# Altium schematic sheet USB_HUB.SchDoc
size Letter; SheetNumber: 10; SheetTotal: 15
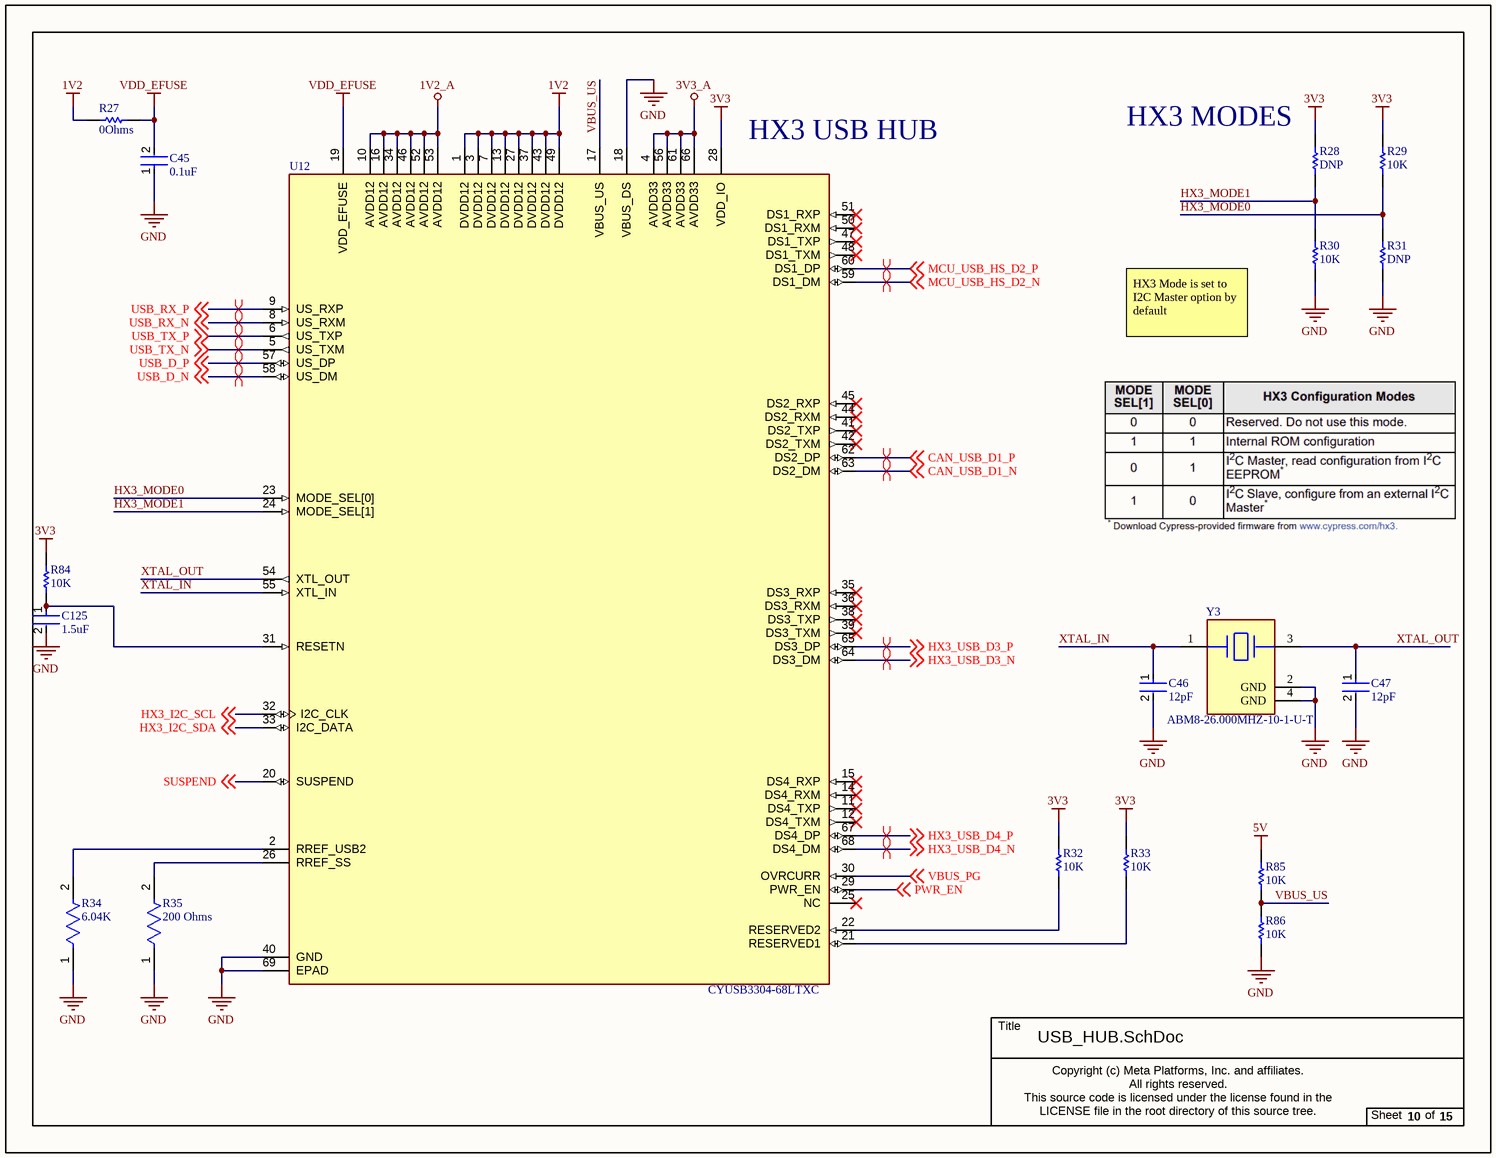
[diagram p0: USB_HUB.SchDoc]

## Parts
C45  0.1uF  [FP-CC0201-BA-MFG]
C46  12pF  [FP-0402-L_1_0_1-W_0_5_0_1-IPC_B]
C47  12pF  [FP-0402-L_1_0_1-W_0_5_0_1-IPC_B]
C125  1.5uF  [FP-C1005-050-0_05-IPC_A]
R27  0Ohms  [RESC1005X40X25ML05T10]
R28  DNP  [RESC1005X40X25ML05T10]
R29  10K  [RESC1005X40X25ML05T10]
R30  10K  [RESC1005X40X25ML05T10]
R31  DNP  [RESC1005X40X25ML05T10]
R32  10K  [RESC1005X40X25ML05T10]
R33  10K  [RESC1005X40X25ML05T10]
R34  6.04K  [FP-RMCF0402-IPC_A]
R35  200 Ohms  [FP-RMCF0402-IPC_B]
R84  10K  [RESC1005X40X25ML05T10]
R85  10K  [RESC1005X40X25ML05T10]
R86  10K  [RESC1005X40X25ML05T10]
U12  CYUSB3304-68LTXC  [QFN40P800X800X100-69M]
Y3  ABM8-26.000MHZ-10-1-U-T  [FP-ABM8-MFG]

## Nets
1V2: R27.2 U12.1(DVDD12) U12.3(DVDD12) U12.7(DVDD12) U12.13(DVDD12) U12.27(DVDD12) U12.37(DVDD12) U12.43(DVDD12) U12.49(DVDD12)
1V2_A: U12.10(AVDD12) U12.16(AVDD12) U12.34(AVDD12) U12.46(AVDD12) U12.52(AVDD12) U12.53(AVDD12)
3V3: R28.2 R29.2 R32.2 R33.2 R84.2 U12.28(VDD_IO)
3V3_A: U12.4(AVDD33) U12.56(AVDD33) U12.61(AVDD33) U12.66(AVDD33)
5V: R85.2
GND: C45.1 C46.2 C47.2 C125.2 R30.1 R31.1 R34.1 R35.1 R86.1 U12.18(VBUS_DS) U12.40(GND) U12.69(EPAD) Y3.2(GND) Y3.4(GND)
VDD_EFUSE: C45.2 R27.1 U12.19(VDD_EFUSE)
CAN_USB_D1_N: U12.63(DS2_DM) ; off-sheet CAN_USB_D1_N
CAN_USB_D1_P: U12.62(DS2_DP) ; off-sheet CAN_USB_D1_P
HX3_I2C_SCL: U12.32(I2C_CLK) ; off-sheet HX3_I2C_SCL
HX3_I2C_SDA: U12.33(I2C_DATA) ; off-sheet HX3_I2C_SDA
HX3_MODE0: R29.1 R31.2 U12.23(MODE_SEL[0])
HX3_MODE1: R28.1 R30.2 U12.24(MODE_SEL[1])
HX3_USB_D3_N: U12.64(DS3_DM) ; off-sheet HX3_USB_D3_N
HX3_USB_D3_P: U12.65(DS3_DP) ; off-sheet HX3_USB_D3_P
HX3_USB_D4_N: U12.68(DS4_DM) ; off-sheet HX3_USB_D4_N
HX3_USB_D4_P: U12.67(DS4_DP) ; off-sheet HX3_USB_D4_P
MCU_USB_HS_D2_N: U12.59(DS1_DM) ; off-sheet MCU_USB_HS_D2_N
MCU_USB_HS_D2_P: U12.60(DS1_DP) ; off-sheet MCU_USB_HS_D2_P
PWR_EN: U12.29(PWR_EN) ; off-sheet PWR_EN
SUSPEND: U12.20(SUSPEND) ; off-sheet SUSPEND
USB_D_N: U12.58(US_DM) ; off-sheet USB_D_N
USB_D_P: U12.57(US_DP) ; off-sheet USB_D_P
USB_RX_N: U12.8(US_RXM) ; off-sheet USB_RX_N
USB_RX_P: U12.9(US_RXP) ; off-sheet USB_RX_P
USB_TX_N: U12.5(US_TXM) ; off-sheet USB_TX_N
USB_TX_P: U12.6(US_TXP) ; off-sheet USB_TX_P
VBUS_PG: U12.30(OVRCURR) ; off-sheet VBUS_PG
VBUS_US: R85.1 R86.2 U12.17(VBUS_US)
XTAL_IN: C46.1 U12.55(XTL_IN) Y3.1
XTAL_OUT: C47.1 U12.54(XTL_OUT) Y3.3
NetC125_1: C125.1 R84.1 U12.31(RESETN)
NetR32_1: R32.1 U12.22(RESERVED2)
NetR33_1: R33.1 U12.21(RESERVED1)
NetR34_2: R34.2 U12.2(RREF_USB2)
NetR35_2: R35.2 U12.26(RREF_SS)

Not connected (* = marked no-connect by the designer): U12 11(DS4_TXP)* 12(DS4_TXM)* 14(DS4_RXM)* 15(DS4_RXP)* 25(NC)* 35(DS3_RXP)* 36(DS3_RXM)* 38(DS3_TXP)* 39(DS3_TXM)* 41(DS2_TXP)* 42(DS2_TXM)* 44(DS2_RXM)* 45(DS2_RXP)* 47(DS1_TXP)* 48(DS1_TXM)* 50(DS1_RXM)* 51(DS1_RXP)*

## Layout directives
differential pair; differential pair class USB_3: USB_RX_N, USB_RX_P, USB_TX_N, USB_TX_P
differential pair; differential pair class USB_2: CAN_USB_D1_N, CAN_USB_D1_P, HX3_USB_D3_N, HX3_USB_D3_P, HX3_USB_D4_N, HX3_USB_D4_P, MCU_USB_HS_D2_N, MCU_USB_HS_D2_P, USB_D_N, USB_D_P

## Notes on the sheet
- (near U12) HX3 USB HUB
- HX3 MODES
- HX3 Mode is set to
  I2C Master option by
  default
- Title
- Copyright (c) Meta Platforms, Inc. and affiliates.
  All rights reserved.
  This source code is licensed under the license found in the
  LICENSE file in the root directory of this source tree.
- Sheet
- of

## Library data of the parts
C45 = CMP-03422-000376-1: CAP CER 0.1UF 6.3V X5R 0201; Manufacturer: Yageo; Manufacturer Part Number: CC0201KRX5R5BB104; Tolerance: 0.1; Temperature Coefficient: 15%; Value: 100 nF; Material: Ceramic; Automotive: No; Device Class L2: Capacitors; Temperature Range High: +85°C; Capacitance: 100 nF; Temperature: -55°C to +85°C; ComponentLink2URL: http://www.yageo.com/documents/recent/UPY-GPHC_X5R_4V-to-50V_25.pdf; Category: Cap; Mouser Description: Multilayer Ceramic Capacitors MLCC - SMD/SMT 100nF 6.3V X5R 10%; Ipc Land Pattern Name: CAPC6030X30; Temperature Characteristic: X5R; Voltage Rating: 6.3 V; Lead Free: Yes; Digikey Description: CAP CER 0.1UF 6.3V X5R 0201; Device Class L1: Passive Components; Octopart: https://octopart.com/cc0201krx5r5bb104-yageo-9292636; Height: 0.33mm; Package: CC0201-BA; Footprint Url: http://www.yageo.com/exep/pages/download/literatures/UPY-C_GEN_24.pdf; ComponentLink2Description: Datasheet; Device Class L3: Ceramic Capacitors; Temperature Range Low: -55°C; RoHS: TRUE
C46 C47 = CMP-2008-02574-2: General Purpose Ceramic Capacitor, 0402, 12pF, 5%, C0G, 30ppm/°C, 50V; Insulation Resistance: 100GR; Radiation Hardening: No; RoHS Compliant: Yes; Voltage Rating: 50V; Case Code (Imperial): 0402; Height: 0.5mm; Voltage: 50V; Voltage Rating (DC): 50V; Mount: Surface Mount; Capacitance: 12pF; Thickness: 0.022inch; Depth: 0.5mm; Max Operating Temperature: 125°C; Construction: Flat; Termination: SMD/SMT; Tolerance: 5%; Length: 1mm; Lead Free: Lead Free; Dielectric: C0G; Number of Pins: 2; Package Quantity: 1; Series: -; Temperature Coefficient: 30ppm/°C; Min Operating Temperature: -55°C; Case/Package: 0402; Packaging: Tape and Reel; Case Code (Metric): 1005; Width: 0.02inch; REACH SVHC: No SVHC
C125 = CMP-08246-006235-1: Multilayer Ceramic Capacitors 1.5μF ±10% 10V X5R SMD 0402; Series: C; Dielectric Material: Ceramic; Tolerance: 10%; RoHS Compliant: Yes; Dielectric: X5R; Packaging: Tape and Reel; Case/Package: 0402; Voltage Rating: 10V; Thickness: 0.022inch; Construction: Flat; Height: 0.5mm; Resistor Type: Ceramic; REACH SVHC: No SVHC; Depth: 0.5mm; Voltage Rating (DC): 10V; Max Operating Temperature: 85°C; Capacitance: 1.5uF; Case Code (Metric): 1005; Number of Pins: 2; Radiation Hardening: No; Width: 0.02inch; Mount: Surface Mount; Weight: 2.3E-05oz; Min Operating Temperature: -55°C; Case Code (Imperial): 0402; Package Quantity: 1; Length: 1mm; Termination: SMD/SMT; Lead Free: Lead Free
R27-R33 R84-R86 = CMP-2002-03043-1: Part Number: CRCW040210K0FKEDHP; Manufacturer: Vishay Dale
R34 = CMP-26527-002652-1: 6.04kΩ ±1% 0.063W 0402 Thick Film Chip Resistor AEC-Q200 compliant; Temperature Coefficient: 100ppm/°C; Resistance: 6.04kR; Max Power Dissipation: 63mW; RoHS Compliant: Yes; Radiation Hardening: No; Tolerance: 1%; Series: RMCF; Resistor Type: Thick Film; Contact Plating: Tin; Case/Package: 0402; Case Code (Metric): 1005; Length: 0.039inch; Height: 0.016inch; Min Operating Temperature: -55°C; Case Code (Imperial): 0402; Width: 0.02inch; Packaging: Tape and Reel; Features: Automotive AEC-Q200; Max Operating Temperature: 155°C; Number of Terminations: 2; Mount: Surface Mount
R35 = CMP-26527-000117-1: 200Ω ±1% 0.063W 0402 Thick Film Chip Resistor AEC-Q200 compliant; Resistance: 200R; Max Power Dissipation: 63mW; Temperature Coefficient: 100ppm/°C; Number of Terminations: 2; RoHS Compliant: Yes; Mount: Surface Mount; Case Code (Imperial): 0402; Resistor Type: Thick Film; Min Operating Temperature: -55°C; Tolerance: 1%; Case/Package: 0402; Radiation Hardening: No; Contact Plating: Tin; Max Operating Temperature: 155°C; Packaging: Tape and Reel; Case Code (Metric): 1005; Features: Automotive AEC-Q200; Series: RMCF; Height: 0.016inch; Width: 0.02inch; Length: 0.039inch
U12 = CYUSB3304-68LTXC: IC USB 3.0 HUB 4-PORT 68QFN; Manufacturer: Cypress Semiconductor; Part Number: CYUSB3304-68LTXC
Y3 = CMP-27762-002739-1: Crystal 26MHz ±10ppm 10pF SMD-4 3.2mm x 2.5mm; ESR (Equivalent Series Resistance): 50R; Width: 2.5mm; Min Operating Temperature: -10°C; Max Operating Temperature: 60°C; Packaging: Tape and Reel; Resistor Type: Ceramic; Frequency Tolerance: 10ppm; Package Quantity: 1000; Case/Package: CSMD; Depth: 2.5mm; REACH SVHC: No SVHC; Load Capacitance: 10pF; Lead Free: Lead Free; Mount: Surface Mount; Termination: SMD/SMT; Number of Pins: 4; Series Resistance: 50R; Operating Frequency: 26 MHz; Tolerance: 10ppm; Frequency Stability: 10ppm; Frequency: 26MHz; Series: ABM8; Height: 0.031inch; Length: 3.2mm